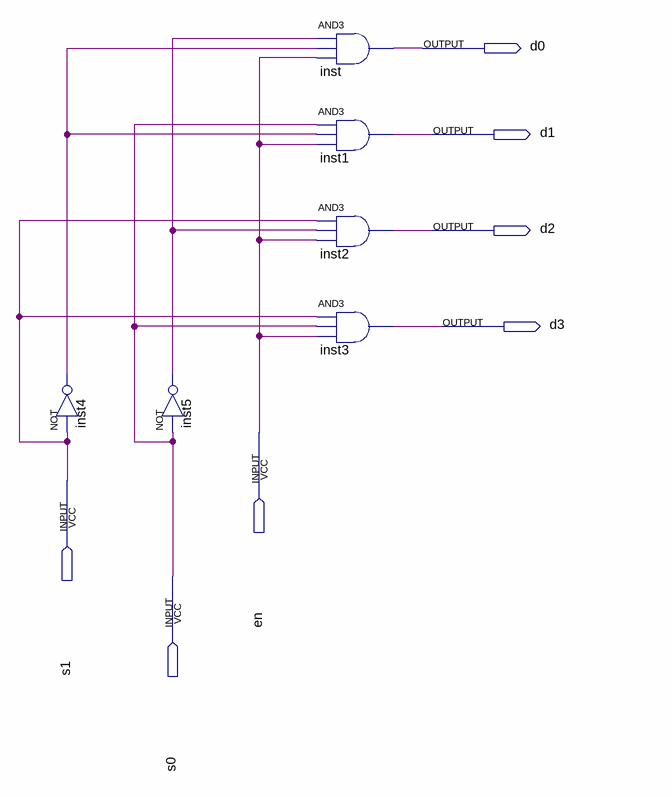
[diagram p0: schematic sheet]
// Quartus schematic dcd2to4.bdf as structural Verilog: 6 symbols, 7 pins
module dcd2to4 (
  input  en,
  input  s1,
  input  s0,
  output d0,
  output d1,
  output d2,
  output d3
);

  wire inst4_out, inst5_out;

  not inst4 (inst4_out, s1);
  not inst5 (inst5_out, s0);
  and inst (d0, inst5_out, inst4_out, en);
  and inst1 (d1, s0, inst4_out, en);
  and inst2 (d2, s1, inst5_out, en);
  and inst3 (d3, s1, s0, en);
endmodule
